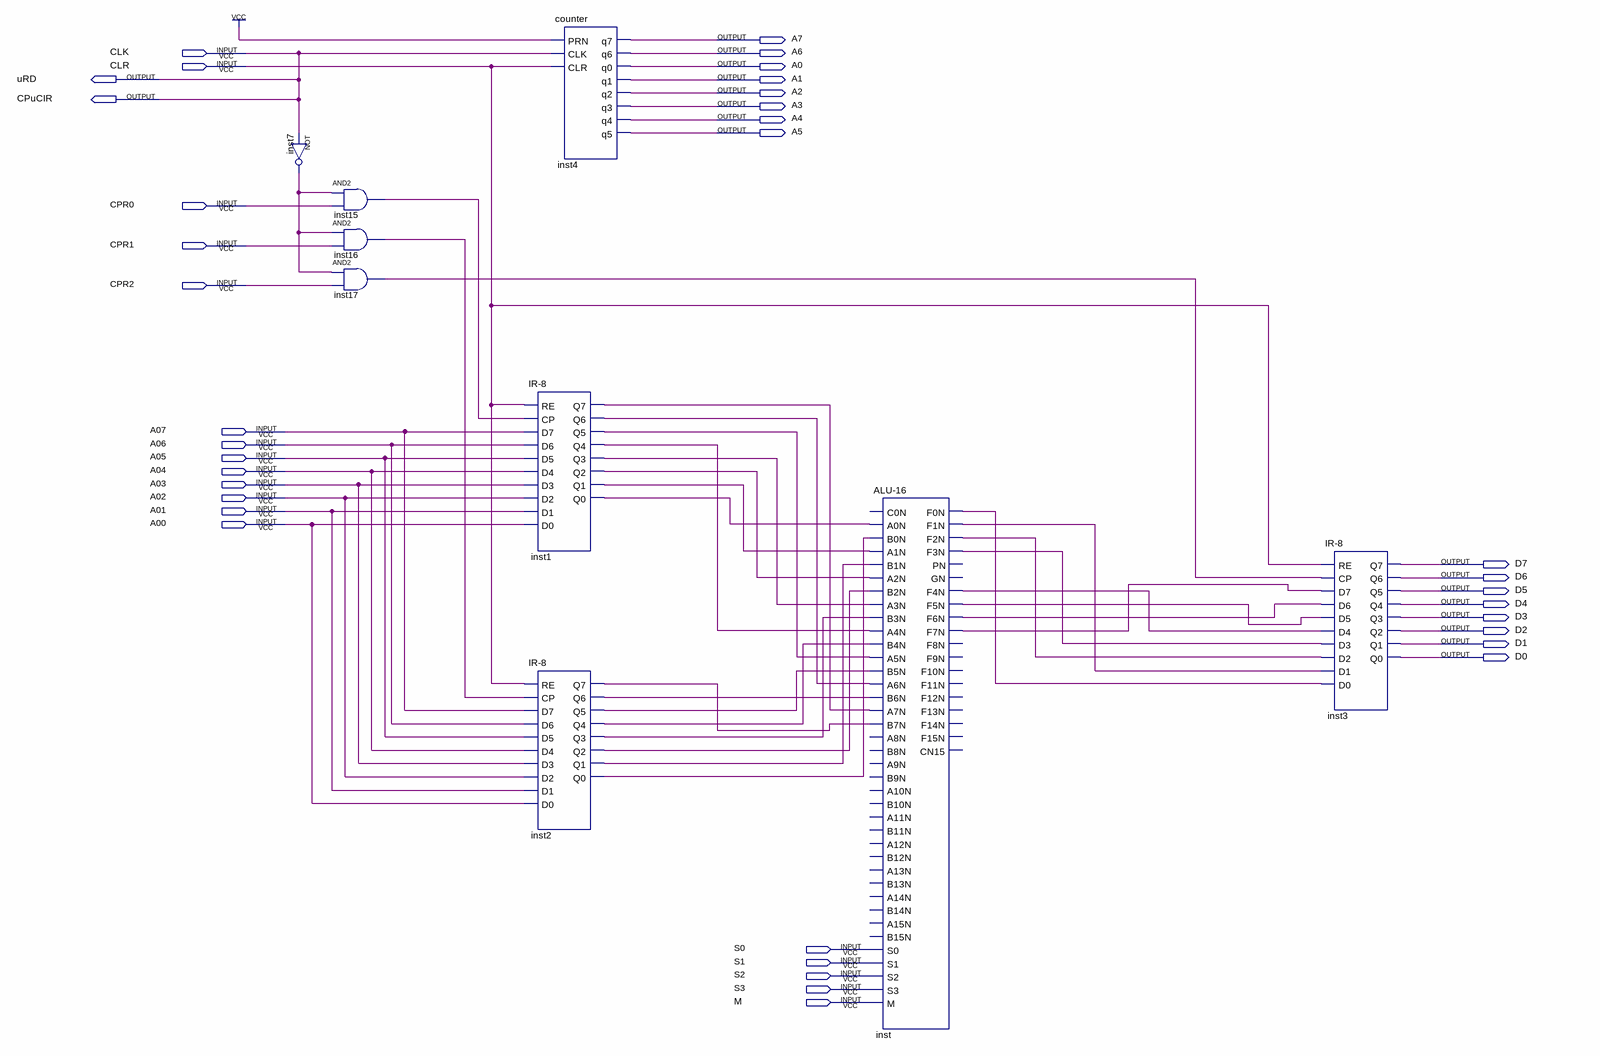
[diagram p0: schematic sheet]
// Quartus schematic microprogramming-ALU.bdf as structural Verilog: 9 symbols, 36 pins
module \microprogramming-ALU  (
  input  CLK,
  input  CLR,
  input  CPR0,
  input  CPR1,
  input  CPR2,
  input  A07,
  input  A06,
  input  A05,
  input  A04,
  input  A03,
  input  A02,
  input  A01,
  input  A00,
  input  S0,
  input  S1,
  input  S2,
  input  S3,
  input  M,
  output A7,
  output A6,
  output A0,
  output uRD,
  output A1,
  output A2,
  output CPuCIR,
  output A3,
  output A4,
  output A5,
  output D7,
  output D6,
  output D5,
  output D4,
  output D3,
  output D2,
  output D1,
  output D0
);

  wire inst1_q0, inst1_q1, inst1_q2, inst1_q3, inst1_q4, inst1_q5, inst1_q6, inst1_q7, inst2_q0, inst2_q1,
       inst2_q2, inst2_q3, inst2_q4, inst2_q5, inst2_q6, inst2_q7, inst7_out, inst15_out, inst16_out,
       inst17_out, inst_f0n, inst_f1n, inst_f2n, inst_f3n, inst_f4n, inst_f5n, inst_f6n, inst_f7n;

  not inst7 (inst7_out, CLK);
  and inst15 (inst15_out, inst7_out, CPR0);
  and inst16 (inst16_out, inst7_out, CPR1);
  and inst17 (inst17_out, inst7_out, CPR2);
  counter inst4 (
    .PRN(1'b1), .CLK(CLK), .CLR(CLR), .q7(A7), .q6(A6), .q0(A0), .q1(A1), .q2(A2), .q3(A3), .q4(A4), .q5(A5));
  \IR-8  inst1 (
    .RE(CLR), .CP(inst15_out), .D7(A07), .D6(A06), .D5(A05), .D4(A04), .D3(A03), .D2(A02), .D1(A01),
    .D0(A00), .Q7(inst1_q7), .Q6(inst1_q6), .Q5(inst1_q5), .Q4(inst1_q4), .Q3(inst1_q3), .Q2(inst1_q2),
    .Q1(inst1_q1), .Q0(inst1_q0));
  \IR-8  inst2 (
    .RE(CLR), .CP(inst16_out), .D7(A07), .D6(A06), .D5(A05), .D4(A04), .D3(A03), .D2(A02), .D1(A01),
    .D0(A00), .Q7(inst2_q7), .Q6(inst2_q6), .Q5(inst2_q5), .Q4(inst2_q4), .Q3(inst2_q3), .Q2(inst2_q2),
    .Q1(inst2_q1), .Q0(inst2_q0));
  \ALU-16  inst (
    .A0N(inst1_q0), .B0N(inst2_q0), .A1N(inst1_q1), .B1N(inst2_q1), .A2N(inst1_q2), .B2N(inst2_q2),
    .A3N(inst1_q3), .B3N(inst2_q3), .A4N(inst1_q4), .B4N(inst2_q4), .A5N(inst1_q5), .B5N(inst2_q5),
    .A6N(inst1_q6), .B6N(inst2_q6), .A7N(inst1_q7), .B7N(inst2_q7), .S0(S0), .S1(S1), .S2(S2), .S3(S3),
    .M(M), .F0N(inst_f0n), .F1N(inst_f1n), .F2N(inst_f2n), .F3N(inst_f3n), .F4N(inst_f4n), .F5N(inst_f5n),
    .F6N(inst_f6n), .F7N(inst_f7n));  // open: C0N, A8N, B8N, A9N, B9N, A10N, B10N, A11N, B11N, A12N, B12N, A13N, B13N, A14N, B14N, A15N, B15N, PN, GN, F8N, F9N, F10N, F11N, F12N, F13N, F14N, F15N, CN15
  \IR-8  inst3 (
    .RE(CLR), .CP(inst17_out), .D7(inst_f7n), .D6(inst_f6n), .D5(inst_f5n), .D4(inst_f4n), .D3(inst_f3n),
    .D2(inst_f2n), .D1(inst_f1n), .D0(inst_f0n), .Q7(D7), .Q6(D6), .Q5(D5), .Q4(D4), .Q3(D3), .Q2(D2),
    .Q1(D1), .Q0(D0));

  assign CPuCIR = CLK;
  assign uRD = CLK;
endmodule
